# Altium schematic sheet bbr18_ball_led_board.SchDoc
size A4
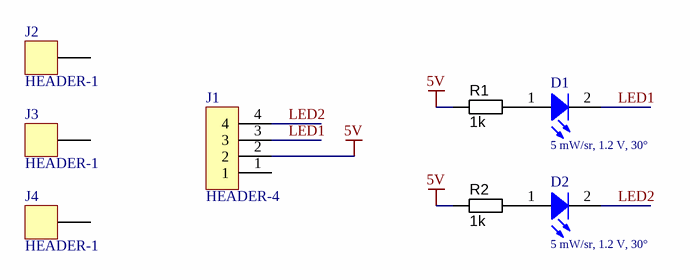
[diagram p0: bbr18_ball_led_board.SchDoc]

## Parts
D1  5 mW/sr, 1.2 V, 30°  [WL-SIRW_1206_15412094A3060_reverse use]
D2  5 mW/sr, 1.2 V, 30°  [WL-SIRW_1206_15412094A3060_reverse use]
J1  HEADER-4  [MICRO-MATCH-MOB-04]
J2  HEADER-1  [2MM-BANANA-VIA]
J3  HEADER-1  [2MM-BANANA-VIA]
J4  HEADER-1  [2MM-BANANA-VIA]
R1  1k  [RESC1608X55N]
R2  1k  [RESC1608X55N]

## Nets
5V: J1.2 R1.1 R2.1
LED1: D1.2(K) J1.3
LED2: D2.2(K) J1.4
NetD1_1: D1.1(A) R1.2
NetD2_1: D2.1(A) R2.2

Not connected (* = marked no-connect by the designer): J1 1; J2 1; J3 1; J4 1

## Notes on the sheet
- Size:
- Date:
- A4
- Sheet
- Drawn by:
- of
- Revision:
- SmartStuff OÜ
- Näituse 26
- 50407 Tartu
- Estonia
- File name:

## Library data of the parts
D1 D2 = 15412094A3060: WL-SIRW SMD Infrared Reverse mount Waterclear Dome, size 1206, 5 mW/sr, 1.2 V, 30°; Forward Voltage: 1.2 V; Peak Wavelength: 940 nm; Radiant Intensity: 5 mW/sr; ComponentLink1Description: Manufacturer; ComponentLink1URL: http://www.we-online.de; ComponentLink2Description: Datasheet; ComponentLink2URL: http://katalog.we-online.de/led/datasheet/15412094A3060.pdf; Part Number: 15412094A3060; Published Date: May 2018; Publisher: Wurth Elektronik; Size: 1206; Viewing Angle: 30°; Operating Temperature: -40 to 85 degC; Centroid Wavelength: 940 nm; Emitting Color: Infrared; Mounting Technology: SMT
R1 R2 = RES_1K_0603_5%: Resistor SMD chip 1k Ohm 0.1W 5% 0603; Manufacturer 1: Yageo; Manufacturer Part Number 1: RC0603JR-071KL; Ratings: 1/10 W; SCDType: spec; Package / Case: 0603 (1608 metric); Tolerance: ±5%; Material: Thick Film; Supplier 1: Digi-Key; Supplier Part Number 1: 311-1.0KGRCT-ND; Supplier 2: Digi-Key; Supplier Part Number 2: 541-1.0KGCT-ND; Manufacturer 2: Vishay Dale; Manufacturer Part Number 2: CRCW06031K00JNEA; ComponentLink2URL: http://www.vishay.com/doc?20008; ComponentLink2Description: http://www.vishay.com/doc?20008; ComponentLink1URL: http://www.yageo.com/documents/recent/PYu-RC0603_51_RoHS_L_4.pdf; ComponentLink1Description: http://www.yageo.com/documents/recent/PYu-RC0603_51_RoHS_L_4.pdf; Value: 1K